# EAGLE design flowerfriend_rev1 (EAGLE 7.2.0)
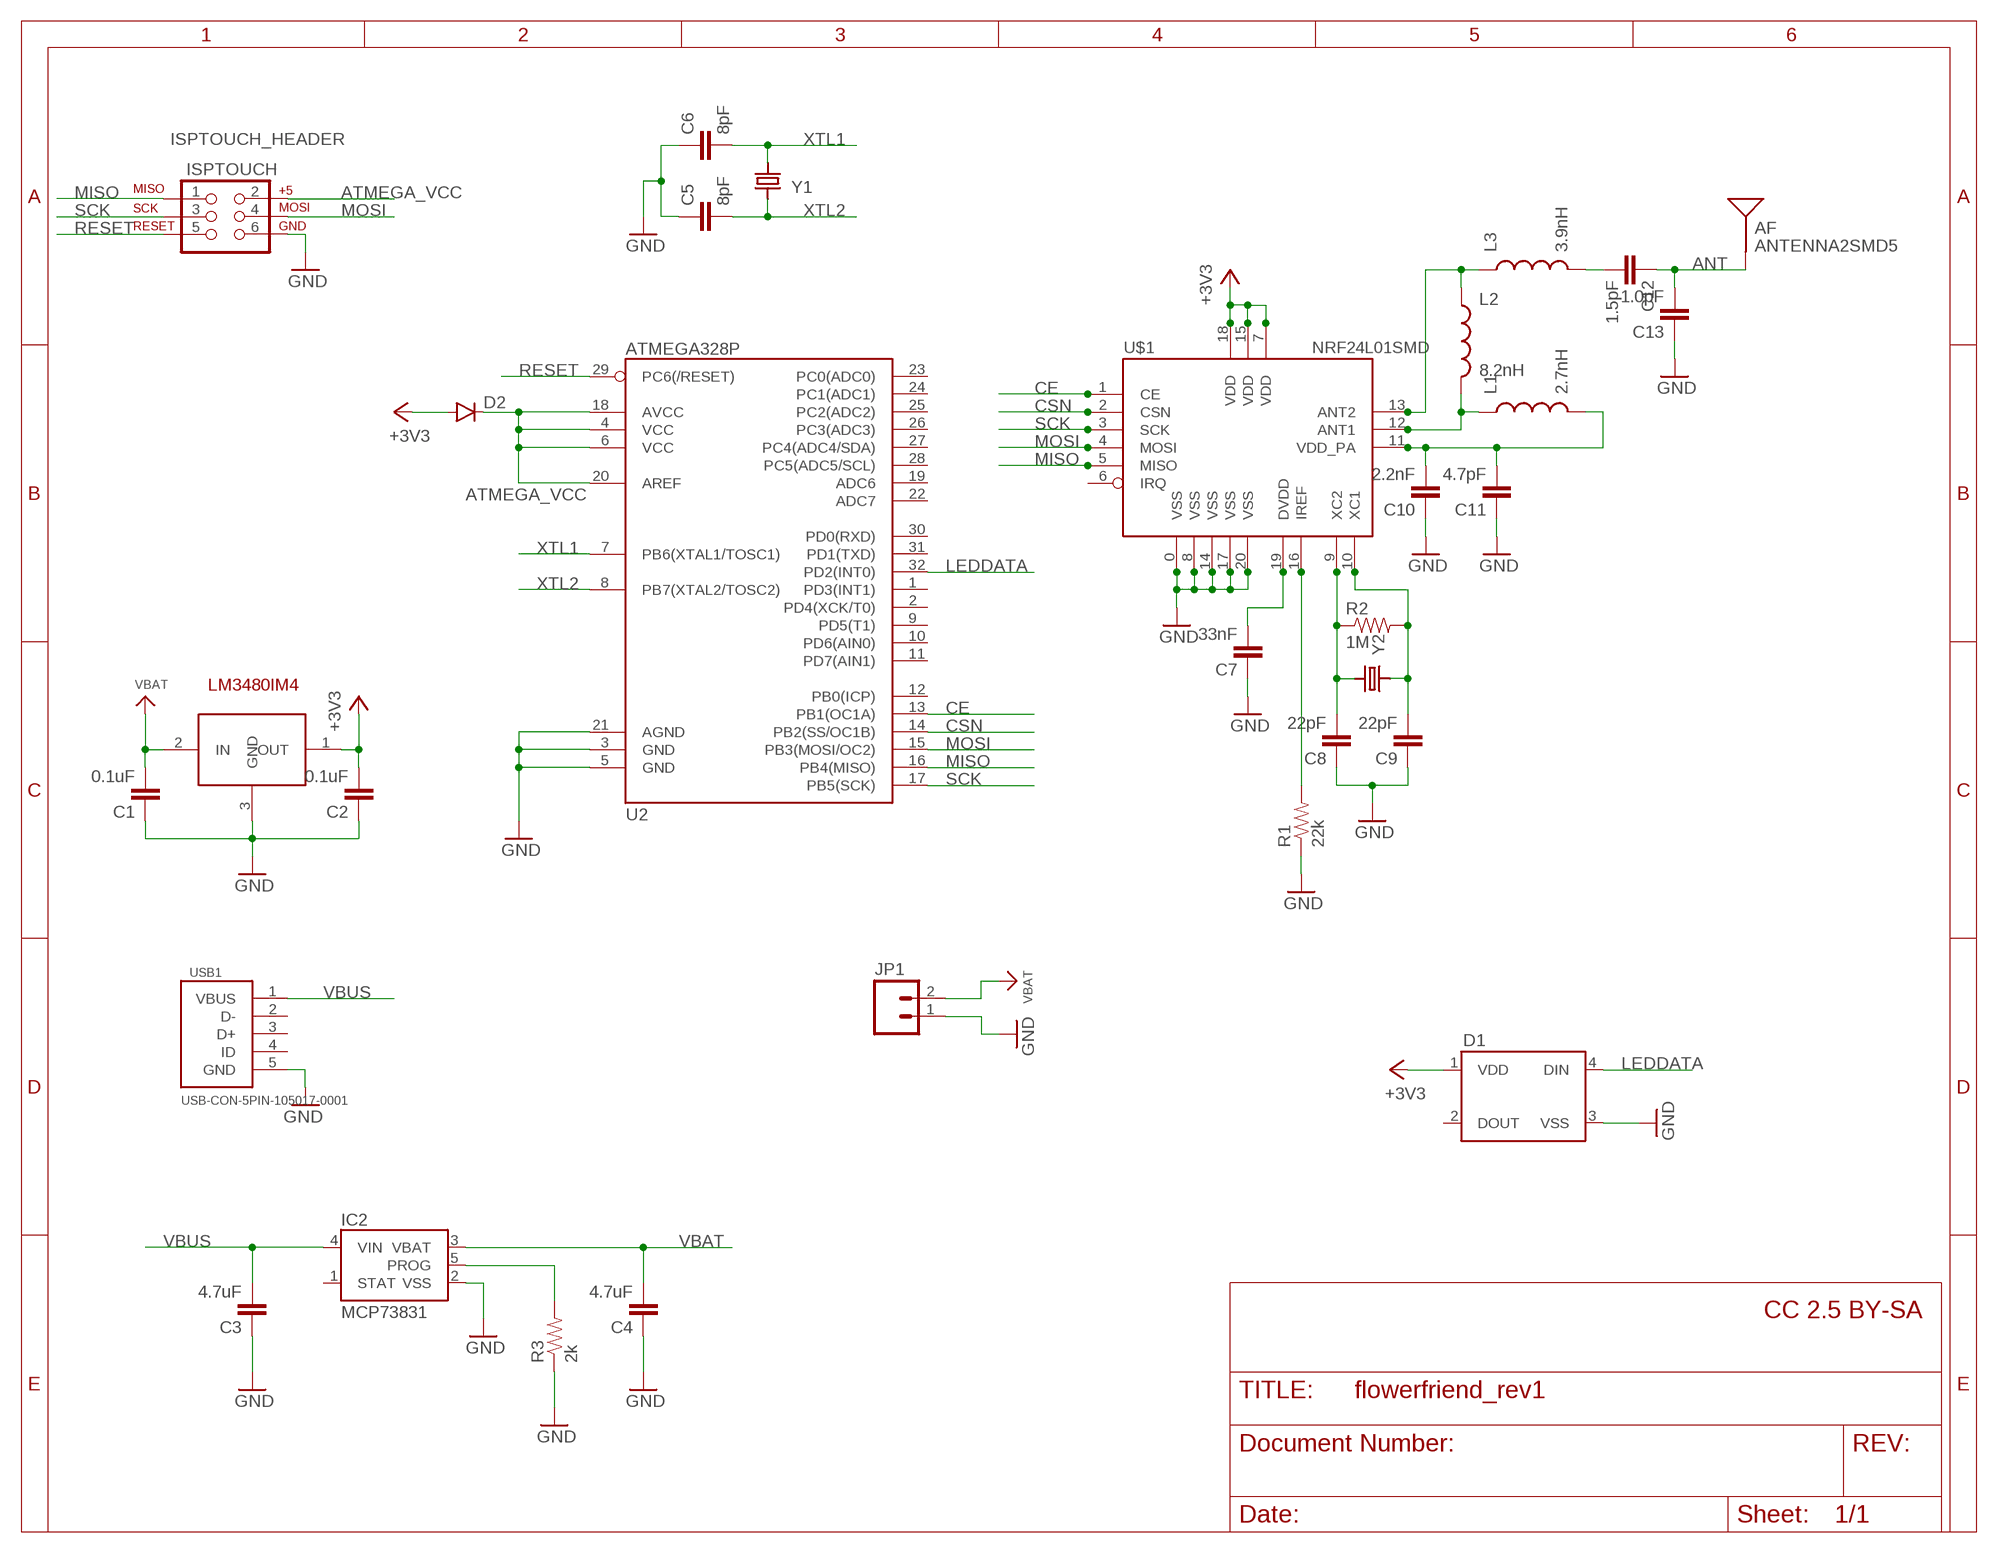
[diagram p0: schematic, sheet 1]

## Parts
AF  ANTENNA2SMD5  [ANTENNA-CHIP5]
C1  0.1uF  CAP0805  [0805]
C2  0.1uF  CAP0805  [0805]
C3  4.7uF  CAP0805  [0805]
C4  4.7uF  CAP0805  [0805]
C5  8pF  CAP0805  [0805]
C6  8pF  CAP0805  [0805]
C7  33nF  CAP0805  [0805]
C8  22pF  CAP0805  [0805]
C9  22pF  CAP0805  [0805]
C10  2.2nF  CAP0805  [0805]
C11  4.7pF  CAP0805  [0805]
C12  1.5pF  CAP0805  [0805]
C13  1.0pF  CAP0805  [0805]
D1  WS2812B  [WS2812B]
D2  DIODESMA  [SMA-DIODE]
IC1  LM3480IM4  [SOT23-3]
IC2  MCP73831  [SOT23-5]
ISPTOUCH  ISPTOUCH_HEADER  [AVX_9188_6-WAY_MATING_GUIDE]
JP1  M02PTH  [1X02]
L1  2.7nH  INDUCTOR0805  [0805]
L2  8.2nH  INDUCTOR0805  [0805]
L3  3.9nH  INDUCTOR0805  [0805]
R1  22k  RESISTOR0805-RES  [0805]
R2  1M  RESISTOR0805-RES  [0805]
R3  2k  RESISTOR0805-RES  [0805]
U2  ATMEGA328P  ATMEGA328_SMT  [TQFP32-08]
U$1  NRF24L01SMD  [QFN20]
USB1  USB-CON-5PIN-105017-0001  [USB-MICRO-MOLEX-105017-0001]
Y1  16MHz  CRYSTAL5X3.2  [NX5032GA]
Y2  16MHz  CRYSTAL5X3.2  [NX5032GA]

## Nets
+3V3 [power]: C2.2 D1.1(VDD) D2.A IC1.1(OUT) U$1.7(VDD) U$1.15(VDD) U$1.18(VDD)
ANT: AF.FEED(SIGNAL) C12.1 C13.2
ATMEGA_VCC [power]: D2.C ISPTOUCH.2 U2.4(VCC) U2.6(VCC) U2.18(AVCC) U2.20(AREF)
CE: U2.13(PB1(OC1A)) U$1.1(CE)
CSN: U2.14(PB2(SS/OC1B)) U$1.2(CSN)
GND [power]: C1.1 C2.1 C3.1 C4.1 C5.1 C6.1 C7.1 C8.1 C9.1 C10.1 C11.1 C13.1 D1.3(VSS) IC1.3(GND) IC2.2(VSS) ISPTOUCH.6 JP1.1 R1.1 R3.1 U2.3(GND) U2.5(GND) U2.21(AGND) U$1.0(VSS) U$1.8(VSS) U$1.14(VSS) U$1.17(VSS) U$1.20(VSS) USB1.5(GND)
LEDDATA: D1.4(DIN) U2.32(PD2(INT0))
MISO: ISPTOUCH.1 U2.16(PB4(MISO)) U$1.5(MISO)
MOSI: ISPTOUCH.4 U2.15(PB3(MOSI/OC2)) U$1.4(MOSI)
N$1: IC2.5(PROG) R3.2
N$4: C8.2 R2.1 U$1.9(XC2) Y2.P$2
N$5: C9.2 R2.2 U$1.10(XC1) Y2.P$1
N$8: L2.1 L3.1 U$1.13(ANT2)
N$9: C10.2 C11.2 L1.2 U$1.11(VDD_PA)
N$10: R1.2 U$1.16(IREF)
N$11: C7.2 U$1.19(DVDD)
N$12: L1.1 L2.2 U$1.12(ANT1)
N$13: C12.2 L3.2
RESET: ISPTOUCH.5 U2.29(PC6(/RESET))
SCK: ISPTOUCH.3 U2.17(PB5(SCK)) U$1.3(SCK)
VBAT [power]: C1.2 C4.2 IC1.2(IN) IC2.3(VBAT) JP1.2
VBUS: C3.2 IC2.4(VIN) USB1.1(VBUS)
XTL1: C6.2 U2.7(PB6(XTAL1/TOSC1)) Y1.P$2
XTL2: C5.2 U2.8(PB7(XTAL2/TOSC2)) Y1.P$1
Unconnected: D1.2(DOUT) IC2.1(STAT) U2.1(PD3(INT1)) U2.2(PD4(XCK/T0)) U2.9(PD5(T1)) U2.10(PD6(AIN0)) U2.11(PD7(AIN1)) U2.12(PB0(ICP)) U2.19(ADC6) U2.22(ADC7) U2.23(PC0(ADC0)) U2.24(PC1(ADC1)) U2.25(PC2(ADC2)) U2.26(PC3(ADC3)) U2.27(PC4(ADC4/SDA)) U2.28(PC5(ADC5/SCL)) U2.30(PD0(RXD)) U2.31(PD1(TXD)) U$1.6(IRQ) USB1.2(D-) USB1.3(D+) USB1.4(ID)

## Notes on the sheet
- CC 2.5 BY-SA

## Library data of the parts
AF = SparkFun-RF:ANTENNA2: Chip antenna Single endded antenna. Common with smaller chip antennas. CHIP4 package is the GPS Chip Antenna SKU: GPS-08418. CHIP5 package is 2.4GHz chip antenna SKU: WRL-00144.
C1-C13 = SparkFun-Passives:CAP: Capacitor Standard 0603 ceramic capacitor, and 0.1" leaded capacitor.
D1 = SparkFun-LED:WS2812B: WS2812B - Intelligent control LED integrated light source Technical Specifications: Power Supply Voltage (VDD): 3.5 to 5.3 V Input Voltage (VI): -0.5 to VDD+0.5 V Operating Junction Temperature (Topt): -25°C to +80°C Storage Temperature Range (Tstg): -55°C to +150°C; PROD_ID: DIO-12503
D2 = SparkFun-DiscreteSemi:DIODE: Diode These are standard reverse protection diodes and small signal diodes. SMA package can handle up to about 1A. SOD-323 can handle about 200mA. What the SOD-323 package when ordering, there are some mfgs out there that are 5-pin packages.
IC1 = SparkFun-PowerIC:LM3480IM4: Small package linear regulator
IC2 = SparkFun-PowerIC:MCP73831: Miniature single cell, fully integrated Li-Ion, Li-polymer charge management controller http://ww1.microchip.com/downloads/en/DeviceDoc/20001984g.pdf IC-09995; PROD_ID: IC-09995
ISPTOUCH = daspilker:ISPTOUCH: ISPtouch for AVR Microcontrollers This 6-pin ISP connector for AVR programming does not require any part on the PCB, but an adapter for a common 6-pin programmer. http://daniel-spilker.com/blog/2011/04/25/isptouch-for-avr-microcontrollers/
JP1 = SparkFun-Connectors:M02: Standard 2-pin 0.1" header. Use with - straight break away headers ( PRT-00116) - right angle break away headers (PRT-00553) - swiss pins (PRT-00743) - machine pins (PRT-00117) - female headers (PRT-00115) Molex polarized connector foot print use with: PRT-08233 with associated crimp pins and housings. 2.54_SCREWTERM for use with PRT-10571. 3.5mm Screw Terminal footprints for PRT-08084 5mm Screw Terminal footprints for use with PRT-08432
L1-L3 = SparkFun-Passives:INDUCTOR: Inductors Basic Inductor/Choke - 0603 and 1206. Footprints are not proven and vary greatly between part numbers. SRN6045- 33uH, 20% 1.4A SDR0403-560KL - 56uH, 10%, 500mA RMS/740mA peak
R1-R3 = SparkFun-Passives:RESISTOR: Resistor Basic schematic elements and footprints for 0603, 1206, and PTH resistors.
U2 = SparkFun-DigitalIC:ATMEGA328_SMT: 32-Pin Atmega328 part Commonly used on Arduino compatible boards Available in QFP and QFN packages TQFP is IC-09069 QFN is non-stock; PROD_ID: IC-09069
U$1 = SparkFun-RF:NRF24L01: 2.4GHz Low Power Transceiver This is the very popular, low cost, very low power RF transceiver from Nordic Semiconductor. Simple SPI interface. SKU: COM-00690
USB1 = GeekAmmo:USB-CON-5PIN: Molex Micro USB 105017-0001
Y1 Y2 = remote:CRYSTAL: Crystals HC49UP - Surface Mount Crystal 4.0MHz 18pF +/-30ppm Surface Mount Crystal [Digikey: 535-9857-1-ND] 12.0 MHz Surface Mount Crystal [Digikey: 535-9869-6-ND] 25.0 MHz Surface Mount Crystal [Digikey: 535-9078-1-ND] 3.2 x 2.5mm - MEMs SMT Crystal 12.0 MHz 8pF 15ppm 3.2 x 2.5mm Crystal [Digikey: 644-1047-1-ND] 16.0 MHz 8pF 15ppm 3.2 x 2.5mm Crystal [Digikey: 644-1049-1-ND] 16.0 MHz 10pF 10ppm 3.2 x 2.5mm Crystal [Digikey: 644-1100-1-ND] 27.12 MHz 18pF 30ppm 3.2 x 2.5mm Crystal [Digikey: 887-1424-1-ND] 4.9 x 1.8mm - MEMs SMT Crystal 32.768 KHz 12.5pF 20ppm 4.9 x 1.8mm Crystal [Digikey: SE2415CT-ND] Cylinder 32.768KHz Cylinder Crystal

## Net classes
1 power: width 0.305 mm

## Board
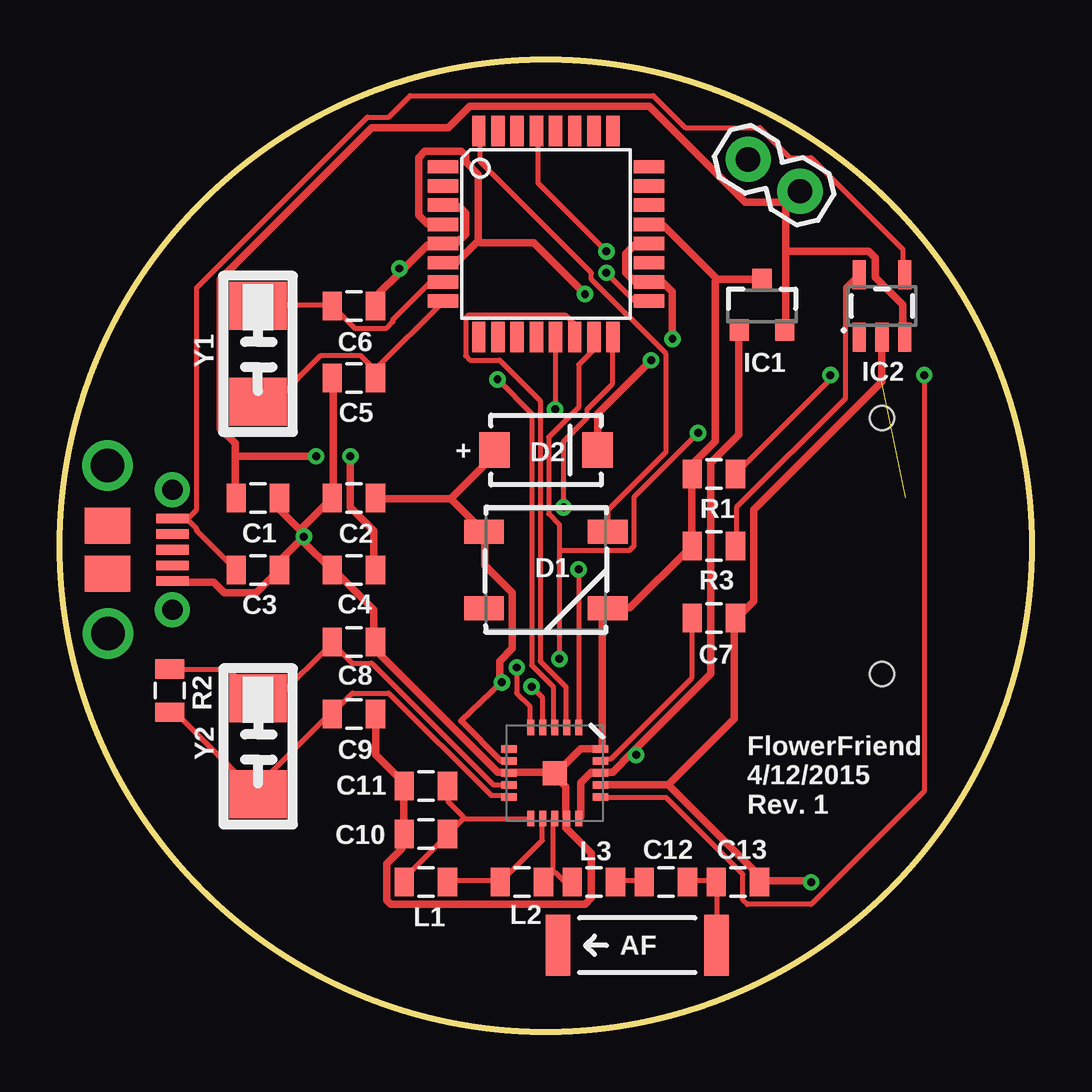
[diagram p1: board, top side]
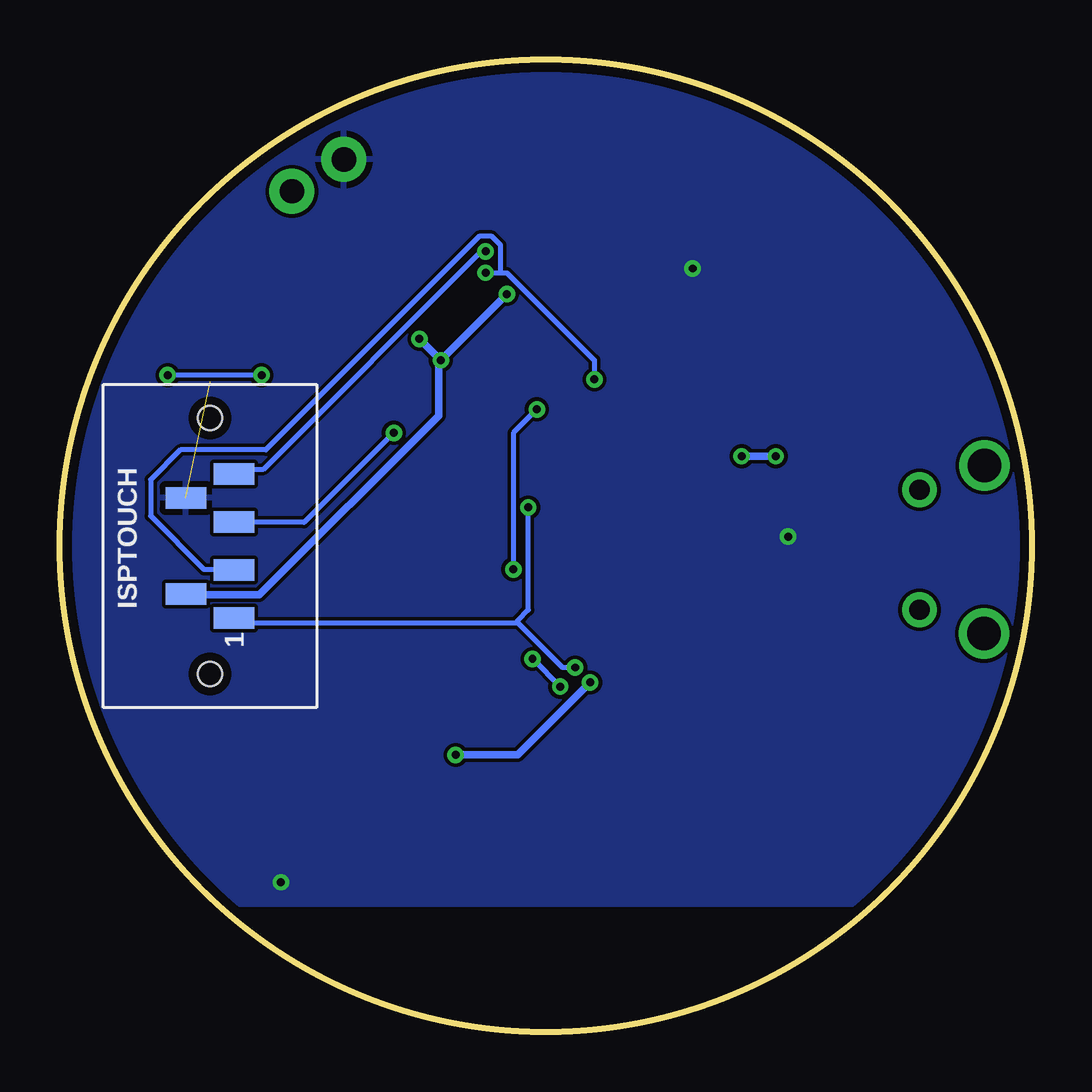
[diagram p2: board, bottom side, seen from below]

Size 40.5 x 40.5 mm. Coordinates in mm from the lower left corner, seen from the top.
Outline: circle at 20.25,20.25 radius 20.25
Copper layers (1*16): Top 0.0356mm / dielectric 1.5011mm / Bottom 0.0356mm
Design rules "LaenPCBOrder *": minimum track width 8mil, minimum drill 13mil, track to track 6mil, track to pad 6mil, pad to pad 6mil, via to via 6mil, smd to smd 6mil, copper to edge 15mil, drill to drill 6mil, minimum pad ring 7mil, minimum via ring 7mil, stop-mask expansion 3mil, vias tented up to drill 0mil, thermal gap 10mil

### Footprints (pad centres in the part's own frame; a part is rotated, then mirrored left to right if it is on the bottom)
ANTENNA-CHIP5 = smd 1.016 x 2.54: FEED -3.302,0; NC 3.302,0
0805 = smd 0.8 x 1.2: 1 -0.9,0; 2 0.9,0
WS2812B = smd 1.651 x 1: 1 -2.577,1.6; 2 -2.577,-1.6; 3 2.577,-1.6; 4 2.577,1.6
SMA-DIODE = smd 1.27 x 1.47: A -2.15,0; C 2.15,0
SOT23-3 = smd 0.8 x 0.9: 1 -0.95,-1; 2 0.95,-1; 3 0,1.1
SOT23-5 = smd 0.55 x 1.2: 1 -0.95,-1.3; 2 0,-1.3; 3 0.95,-1.3; 4 0.95,1.3; 5 -0.95,1.3
AVX_9188_6-WAY_MATING_GUIDE = smd 0.9 x 1.7: 1 -3,-1; 2 -2,1; 3 -1,-1; 4 1,-1; 5 3,-1; 6 2,1 | hole 1: -5.334,0; 5.334,0
1X02 = drill 1.016 pad 1.88: 1 0,0; 2 2.54,0
TQFP32-08 = smd 1.27 x 0.559: 1 -4.293,2.8; 2 -4.293,2; 3 -4.293,1.2; 4 -4.293,0.4; 5 -4.293,-0.4; 6 -4.293,-1.2; 7 -4.293,-2; 8 -4.293,-2.8; 17 4.293,-2.8; 18 4.293,-2; 19 4.293,-1.2; 20 4.293,-0.4; 21 4.293,0.4; 22 4.293,1.2; 23 4.293,2; 24 4.293,2.8 | smd 0.559 x 1.27: 9 -2.8,-4.293; 10 -2,-4.293; 11 -1.2,-4.293; 12 -0.4,-4.293; 13 0.4,-4.293; 14 1.2,-4.293; 15 2,-4.293; 16 2.8,-4.293; 25 2.8,4.293; 26 2,4.293; 27 1.2,4.293; 28 0.4,4.293; 29 -0.4,4.293; 30 -1.2,4.293; 31 -2,4.293; 32 -2.8,4.293
QFN20 = smd 1 x 1: 0 0,0 | smd 0.65 x 0.3: 1 -1.9,1; 2 -1.9,0.5; 3 -1.9,0; 4 -1.9,-0.5; 5 -1.9,-1; 11 1.9,-1; 12 1.9,-0.5; 13 1.9,0; 14 1.9,0.5; 15 1.9,1 | smd 0.3 x 0.65: 6 -1,-1.9; 7 -0.5,-1.9; 8 0,-1.9; 9 0.5,-1.9; 10 1,-1.9; 16 1,1.9; 17 0.5,1.9; 18 0,1.9; 19 -0.5,1.9; 20 -1,1.9
USB-MICRO-MOLEX-105017-0001 = smd 0.4 x 1.35: 1 1.2,0; 2 1.85,0; 3 2.5,0; 4 3.15,0; 5 3.8,0 | drill 0.85 pad 1.45: P$1 0,0; P$2 5,0 | smd 1.5 x 1.9: P$3 3.5,-2.7; P$4 1.5,-2.7 | drill 1.4: P$5 -1.004,-2.701; P$6 5.999,-2.69
NX5032GA = smd 2 x 2.4: P$1 -2,0; P$2 2,0

### Placement (x,y rotation side)
AF  24.05,3.61 180 top
C1  8.25,22.25 180 top
C2  12.25,22.25 0 top
C3  8.25,19.25 180 top
C4  12.25,19.25 0 top
C5  12.25,27.25 0 top
C6  12.25,30.25 180 top
C7  27.25,17.25 180 top
C8  12.25,16.25 180 top
C9  12.25,13.25 180 top
C10  15.25,8.25 0 top
C11  15.25,10.25 0 top
C12  25.25,6.25 180 top
C13  28.25,6.25 180 top
D1  20.25,19.25 0 top
D2  20.25,24.25 0 top
IC1  29.25,30.25 0 top
IC2  34.25,30.25 0 top
ISPTOUCH  34.25,20.25 90 bottom
JP1  28.67,36.36 328.4 top
L1  15.25,6.25 180 top
L2  19.25,6.25 180 top
L3  22.25,6.25 0 top
R1  27.25,23.25 0 top
R2  4.57,14.22 270 top
R3  27.25,20.25 0 top
U2  20.25,33.25 0 top
U$1  20.61,10.79 270 top
USB1  4.68,22.59 270 top
Y1  8.25,28.25 90 top
Y2  8.26,11.89 90 top

### Tracks (layer width: path | path; a pad name or v marks a point on that pad's centre or on a via)
+3V3  (via drill 0.33)
  Top 0.254: U$1.7 18.4,11.29 16.72,12.97 v18.41,14.56
  Top 0.305: 16.27,22.21 13.16,22.21 C2.2 | 16.27,22.21 17.61,20.87 D1.1 17.7,20.7 17.7,19.45 18.85,18.3 18.85,15.99 18.32,15.45 18.32,14.65 v18.41,14.56 | 16.27,22.21 18.05,23.99 18.05,24.16 D2.A | U$1.15 21.7,8.96 21.7,10.38 22.14,10.83 22.5,10.83 U$1.18 22.59,10.83 23.03,10.83 23.83,11.63 | 23.83,11.63 27.12,14.92 27.12,23.72 28.28,24.88 28.28,29.23 IC1.1 | v24.01,11.54 23.92,11.54 23.83,11.63
  Bottom 0.305: v18.41,14.56 21.43,11.54 v24.01,11.54
ANT
  Top 0.203: C12.1 26.23,6.3 27.3,6.3 C13.2 27.39,6.21 27.39,3.63 AF.FEED
ATMEGA_VCC  (via drill 0.33)
  Top 0.305: 17.43,32.97 16.54,32.08 16.01,32.08 U2.6 | 17.43,32.97 17.43,35.72 16.9,36.25 16.9,36.52 16.72,36.7 15.21,36.7 14.94,36.43 14.94,34.03 15.3,33.68 15.92,33.68 U2.4 | U2.20 24.45,32.79 23.92,32.79 23.56,32.43 23.56,31.63 23.92,31.28 24.45,31.28 U2.18 24.63,31.19 25.16,31.19 25.52,30.83 v25.52,28.88 | v24.63,27.99 22.41,25.76 D2.C | v21.88,30.74 19.74,32.88 17.52,32.88 17.43,32.97
  Bottom 0.305: v25.52,28.88 v24.63,27.99 | ISPTOUCH.2 35.21,18.21 32.19,18.21 24.72,25.68 24.72,27.9 v24.63,27.99 | v24.63,27.99 v21.88,30.74
CE  (via drill 0.33)
  Top 0.203: v21.61,19.27 U$1.1 | v20.63,25.94 20.63,28.88 U2.13
  Bottom 0.203: v21.61,19.27 21.61,24.96 v20.63,25.94
CSN
  Top 0.203: U$1.2 21.08,12.7 21.08,14.39 20.01,15.45 20.01,26.3 18.32,27.99 17.07,27.99 16.9,28.16 16.9,29.76 16.99,29.85 21.08,29.85 21.43,29.5 21.43,28.96 U2.14
GND  (via drill 0.33)  (1 unrouted)
  Top 0.305: 25.34,10.3 22.59,10.3 U$1.17 | 25.34,10.3 29.08,6.56 29.08,6.3 C13.1 29.25,6.3 31.21,6.3 v31.3,6.24 | 25.34,10.3 28.1,13.05 28.1,17.23 C7.1 28.28,17.32 28.9,17.94 28.9,21.76 34.23,27.1 34.23,28.88 IC2.2 | 14.23,31.72 15.3,32.79 15.92,32.79 U2.5 16.1,32.88 16.54,32.88 16.9,33.23 16.9,34.12 16.63,34.39 16.01,34.39 U2.3 | 14.23,31.72 13.16,30.65 13.16,30.3 C6.1 | v10.16,20.63 10.14,20.61 9.16,19.63 9.16,19.27 C3.1 9.07,19.19 8.18,18.3 6.85,18.3 6.41,18.74 4.72,18.74 USB1.5 | v10.16,20.63 10.14,20.43 11.3,19.27 C4.1 11.47,19.19 13.07,17.59 13.07,16.25 C8.1 13.25,16.16 13.25,15.81 18.23,10.83 18.59,10.83 U$1.8 18.76,10.83 20.54,10.83 U$1.0 | C1.1 9.16,22.21 9.16,21.76 10.14,20.79 v10.16,20.63 | v10.16,20.63 10.05,20.96 11.3,22.21 C2.1 11.39,22.39 11.39,27.19 C5.1 | v14.14,31.81 14.23,31.72 | 27.39,31.37 29.17,31.37 IC1.3 | 27.39,31.37 25.16,33.59 24.54,33.59 U2.21 | C9.1 13.16,13.23 13.16,11.54 14.32,10.38 C11.1 14.32,10.21 14.32,8.25 C10.1 14.23,8.16 14.23,7.63 13.61,7.01 13.61,5.5 13.79,5.32 21.88,5.32 22.14,5.58 22.14,7.45 21.08,8.52 21.08,8.78 U$1.14 21.08,8.96 21.08,10.21 20.63,10.65 U$1.0 | U$1.0 20.72,10.83 21.7,11.81 22.5,11.81 U$1.20 22.59,11.9 22.59,17.23 22.85,17.5 D1.3 22.85,17.67 23.74,17.67 26.23,20.16 R3.1 26.32,20.25 26.32,23.19 R1.1 26.41,23.36 26.41,23.72 27.3,24.61 27.3,31.28 27.39,31.37
  pour Bottom: 41.25,5.25 -0.75,5.25 -0.75,41.25 41.25,41.25
LEDDATA
  Top 0.203: U2.32 17.52,37.5 17.52,36.25 22.14,31.63 22.14,31.37 25.25,28.25 25.25,24.16 22.85,21.76 22.85,20.87 D1.4
MISO  (via drill 0.33)
  Top 0.203: v19.03,15.19 19.03,14.12 19.56,13.59 19.56,12.7 U$1.5 | v20.99,21.85 20.99,24.61 21.96,25.59 21.96,25.94 23.03,27.01 23.03,28.88 U2.16
  Bottom 0.203: v19.03,15.19 19.56,15.19 21.43,17.05 | 21.43,17.05 32.99,17.05 33.17,17.23 ISPTOUCH.1 | v20.99,21.85 20.99,17.59 21.43,17.14 21.43,17.05
MOSI  (via drill 0.33)
  Top 0.203: v19.65,14.39 20.1,13.94 20.1,12.7 U$1.4 | 20.81,20.07 20.81,21.14 20.36,21.59 20.36,24.79 21.61,26.03 21.61,27.81 22.23,28.43 22.23,28.88 U2.15 | 20.81,20.07 v20.81,15.54 | v26.59,24.96 23.92,22.3 23.92,20.25 23.74,20.07 20.81,20.07
  Bottom 0.203: v20.81,15.54 v19.65,14.39 | v26.59,24.96 30.32,21.23 33.17,21.23 ISPTOUCH.4
N$1
  Top 0.203: R3.2 28.19,20.25 28.19,21.85 32.72,26.39 32.72,31.01 33.25,31.54 IC2.5
N$4
  Top 0.203: R2.1 4.63,15.1 7.03,15.1 8.18,13.94 Y2.P$2 8.27,13.94 9.07,13.94 11.3,16.16 C8.2 11.39,16.16 12.19,15.36 12.99,15.36 18.05,10.3 18.67,10.3 U$1.9
N$5
  Top 0.203: R2.2 4.63,13.32 4.81,13.32 8.18,9.94 Y2.P$1 8.1,10.12 11.3,13.32 C9.2 11.39,13.32 12.19,14.12 13.7,14.12 17.96,9.85 18.67,9.85 U$1.10
N$8
  Top 0.203: 20.54,6.65 20.54,8.87 U$1.13 | 20.54,6.65 20.19,6.3 L2.1 | L3.1 21.34,6.3 20.99,6.3 20.63,6.65 20.54,6.65
N$9
  Top 0.203: 16.81,8.87 19.56,8.87 U$1.11 | 16.81,8.87 16.19,8.25 C10.2 16.1,8.16 14.41,6.47 14.41,6.3 L1.2 | C11.2 16.19,10.21 16.19,9.58 16.81,8.96 16.81,8.87
N$10  (via drill 0.33)
  Top 0.203: v36.01,27.36 36.01,10.03 31.3,5.32 28.63,5.32 28.45,5.5 28.45,6.56 25.25,9.76 22.59,9.76 U$1.16 | v32.1,27.36 32.1,27.19 28.19,23.28 R1.2
  Bottom 0.203: v32.1,27.36 v36.01,27.36
N$11
  Top 0.203: U$1.19 22.59,11.36 22.94,11.36 26.32,14.74 26.32,17.23 C7.2
N$12
  Top 0.203: U$1.12 20.1,8.87 20.1,7.98 18.41,6.3 L2.2 18.32,6.3 16.19,6.3 L1.1
N$13
  Top 0.203: L3.2 23.21,6.3 24.28,6.3 C12.2
RESET  (via drill 0.33)
  Top 0.203: v22.76,32.52 19.92,35.37 19.92,37.5 U2.29
  Bottom 0.203: v22.76,32.52 22.94,32.52 32.01,23.45 32.99,23.45 33.17,23.28 ISPTOUCH.5
SCK  (via drill 0.33)
  Top 0.203: v18.23,27.19 19.65,25.76 19.65,15.27 20.54,14.39 20.54,12.7 U$1.3 | v22.76,31.63 23.92,30.48 24.45,30.48 U2.17
  Bottom 0.203: v18.23,27.19 18.23,27.99 21.88,31.63 22.14,31.63 | v22.76,31.63 22.14,31.63 | 22.14,31.63 22.14,32.79 22.5,33.14 23.03,33.14 31.92,24.25 35.48,24.25 36.72,23.01 36.72,21.5 34.5,19.27 33.25,19.27 ISPTOUCH.3
VBAT  (via drill 0.33)
  Top 0.305: 30.23,32.52 30.23,34.48 30.77,35.01 JP1.2 30.14,34.57 28.54,34.57 24.54,38.57 17.07,38.57 16.19,37.68 12.99,37.68 6.67,31.37 6.67,25.14 7.3,24.52 7.3,23.99 | 30.23,32.52 30.23,29.32 IC1.2 | 7.3,23.99 7.3,22.3 C1.2 | v12.1,23.99 12.1,21.85 13.07,20.87 13.07,19.27 C4.2 | 7.3,23.99 v10.67,23.99 | 30.23,32.52 33.7,32.52 33.97,32.25 33.97,31.45 35.12,30.3 35.12,28.96 IC2.3
  Bottom 0.305: v10.67,23.99 v12.1,23.99
VBUS
  Top 0.203: C3.2 7.3,19.27 5.7,20.87 5.7,20.96 5.34,21.32 4.72,21.32 USB1.1 5.34,21.41 5.7,21.76 5.7,31.01 12.81,38.12 13.7,38.12 14.59,39.01 24.72,39.01 26.05,37.68 29.17,37.68 30.41,36.43 31.3,36.43 35.12,32.61 35.12,31.63 IC2.4
XTL1
  Top 0.203: Y1.P$2 8.27,30.3 11.3,30.3 C6.2 11.39,30.21 12.27,29.32 13.61,29.32 13.87,29.59 13.87,29.68 15.39,31.19 15.92,31.19 U2.7
XTL2
  Top 0.203: U2.8 15.92,30.39 13.16,27.63 13.16,27.28 C5.2 13.07,27.63 12.54,28.16 10.85,28.16 8.98,26.3 8.27,26.3 Y1.P$1

### Text on the board
tNames: + | FlowerFriend / 4/12/2015 / Rev. 1